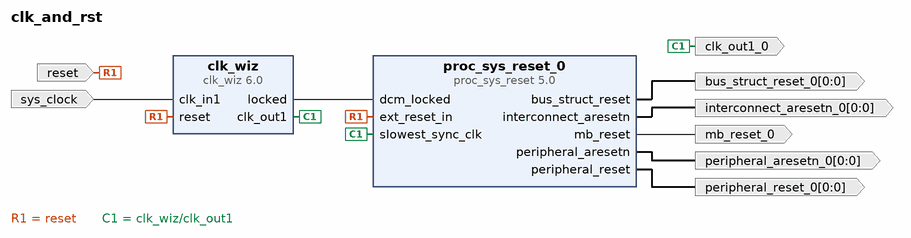
[diagram p0: block diagram of the top level]
# Vivado block design clk_and_rst, xc7z100ffg900-2, Vivado 2019.1
create_bd_design clk_and_rst

create_bd_port -dir I -type rst reset
set_property -dict {CONFIG.POLARITY ACTIVE_HIGH} [get_bd_ports reset]
create_bd_port -dir I -type clk sys_clock
set_property -dict {CONFIG.FREQ_HZ 50000000} [get_bd_ports sys_clock]
create_bd_port -dir O -from 0 -to 0 -type rst bus_struct_reset_0
create_bd_port -dir O -from 0 -to 0 -type rst interconnect_aresetn_0
create_bd_port -dir O -type rst mb_reset_0
create_bd_port -dir O -from 0 -to 0 -type rst peripheral_aresetn_0
create_bd_port -dir O -from 0 -to 0 -type rst peripheral_reset_0
create_bd_port -dir O -type clk clk_out1_0
set_property -dict {CONFIG.FREQ_HZ 50000000} [get_bd_ports clk_out1_0]

create_bd_cell -type ip -vlnv xilinx.com:ip:proc_sys_reset:5.0 proc_sys_reset_0
set_property -dict {CONFIG.RESET_BOARD_INTERFACE reset CONFIG.USE_BOARD_FLOW true} [get_bd_cells proc_sys_reset_0]
create_bd_cell -type ip -vlnv xilinx.com:ip:clk_wiz:6.0 clk_wiz
set_property -dict [list \
  CONFIG.CLKIN1_JITTER_PS 200.0 \
  CONFIG.CLKOUT1_JITTER 192.113 \
  CONFIG.CLKOUT1_PHASE_ERROR 164.985 \
  CONFIG.CLKOUT1_REQUESTED_OUT_FREQ 50.000 \
  CONFIG.MMCM_CLKFBOUT_MULT_F 20.000 \
  CONFIG.MMCM_CLKIN1_PERIOD 20.000 \
  CONFIG.MMCM_CLKOUT0_DIVIDE_F 20.000 \
  CONFIG.MMCM_DIVCLK_DIVIDE 1 \
  CONFIG.PRIM_IN_FREQ 50.000 \
  CONFIG.RESET_BOARD_INTERFACE reset \
  CONFIG.USE_BOARD_FLOW true \
] [get_bd_cells clk_wiz]

# ---- connections ----

connect_bd_net [get_bd_ports reset] [get_bd_pins proc_sys_reset_0/ext_reset_in] [get_bd_pins clk_wiz/reset]
connect_bd_net -net clk_100MHz_1 [get_bd_ports sys_clock] [get_bd_pins clk_wiz/clk_in1]
connect_bd_net [get_bd_pins clk_wiz/locked] [get_bd_pins proc_sys_reset_0/dcm_locked]
connect_bd_net [get_bd_pins proc_sys_reset_0/bus_struct_reset] [get_bd_ports bus_struct_reset_0]
connect_bd_net [get_bd_pins proc_sys_reset_0/interconnect_aresetn] [get_bd_ports interconnect_aresetn_0]
connect_bd_net [get_bd_pins proc_sys_reset_0/mb_reset] [get_bd_ports mb_reset_0]
connect_bd_net [get_bd_pins proc_sys_reset_0/peripheral_aresetn] [get_bd_ports peripheral_aresetn_0]
connect_bd_net [get_bd_pins proc_sys_reset_0/peripheral_reset] [get_bd_ports peripheral_reset_0]
connect_bd_net [get_bd_pins clk_wiz/clk_out1] [get_bd_ports clk_out1_0] [get_bd_pins proc_sys_reset_0/slowest_sync_clk]

validate_bd_design
save_bd_design
